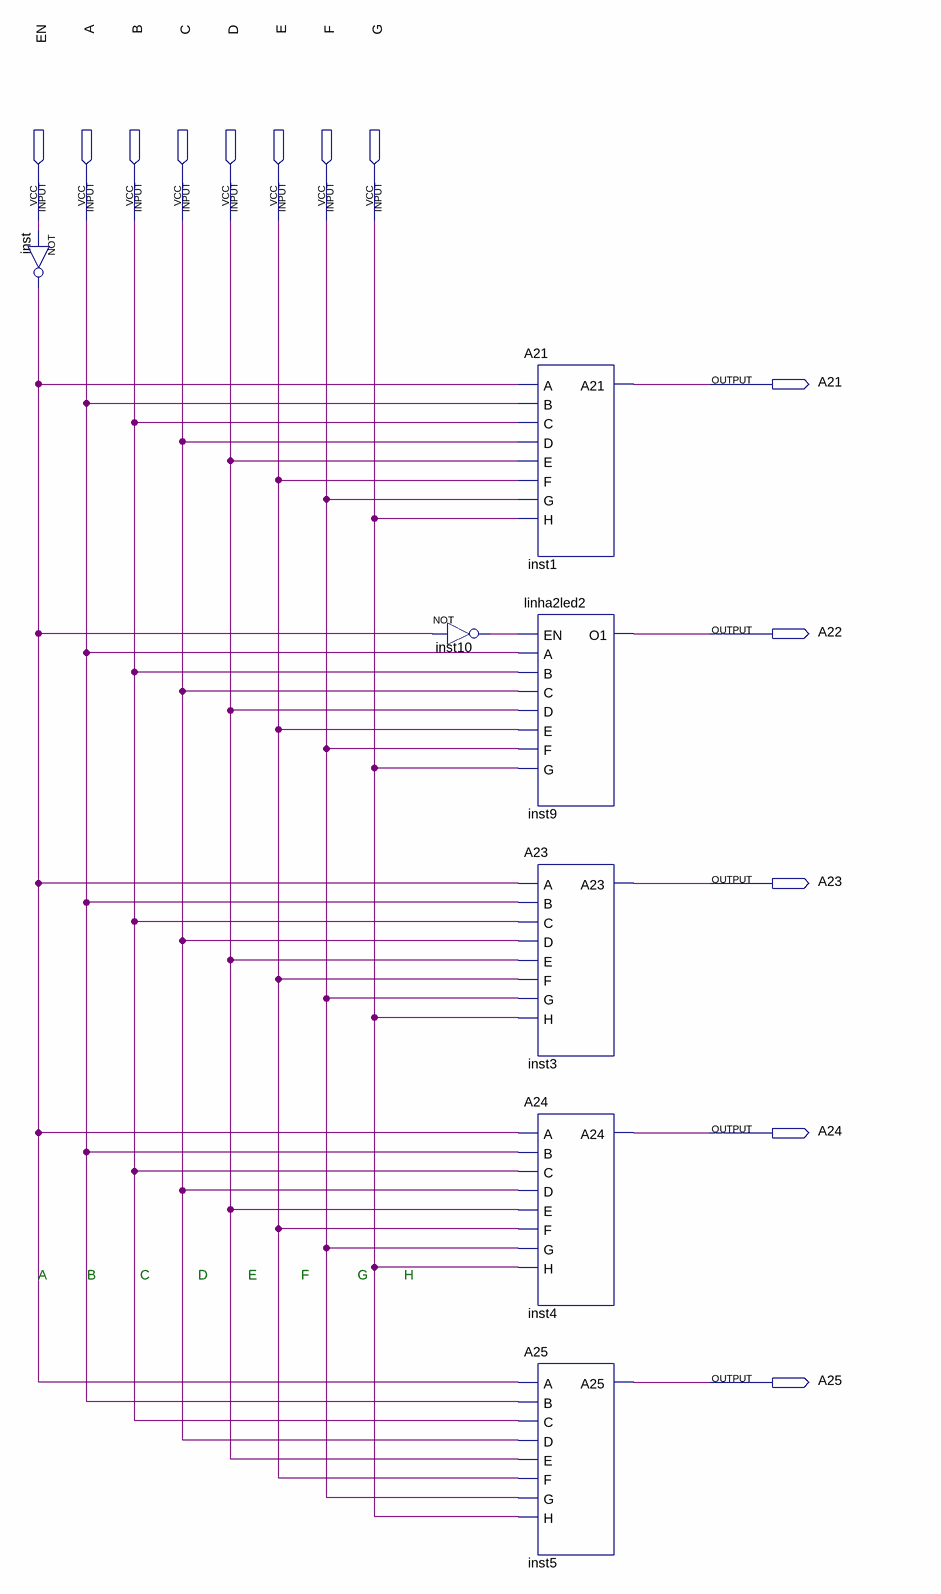
[diagram p0: schematic sheet]
// Quartus schematic Linha2.bdf as structural Verilog: 7 symbols, 13 pins
module Linha2 (
  input  EN,
  input  A,
  input  B,
  input  C,
  input  D,
  input  E,
  input  F,
  input  G,
  output A21,
  output A22,
  output A23,
  output A24,
  output A25
);

  wire inst10_out, inst_out;

  not inst (inst_out, EN);
  not inst10 (inst10_out, inst_out);
  A21 inst1 (.A(inst_out), .B(A), .C(B), .D(C), .E(D), .F(E), .G(F), .H(G), .A21(A21));
  linha2led2 inst9 (.EN(inst10_out), .A(A), .B(B), .C(C), .D(D), .E(E), .F(F), .G(G), .O1(A22));
  A23 inst3 (.A(inst_out), .B(A), .C(B), .D(C), .E(D), .F(E), .G(F), .H(G), .A23(A23));
  A24 inst4 (.A(inst_out), .B(A), .C(B), .D(C), .E(D), .F(E), .G(F), .H(G), .A24(A24));
  A25 inst5 (.A(inst_out), .B(A), .C(B), .D(C), .E(D), .F(E), .G(F), .H(G), .A25(A25));

  // Notes on the sheet:
  //   A          B           C            D          E           F            G         H
endmodule
